# EAGLE design SPI Bus Buffer (EAGLE 7.2.0)
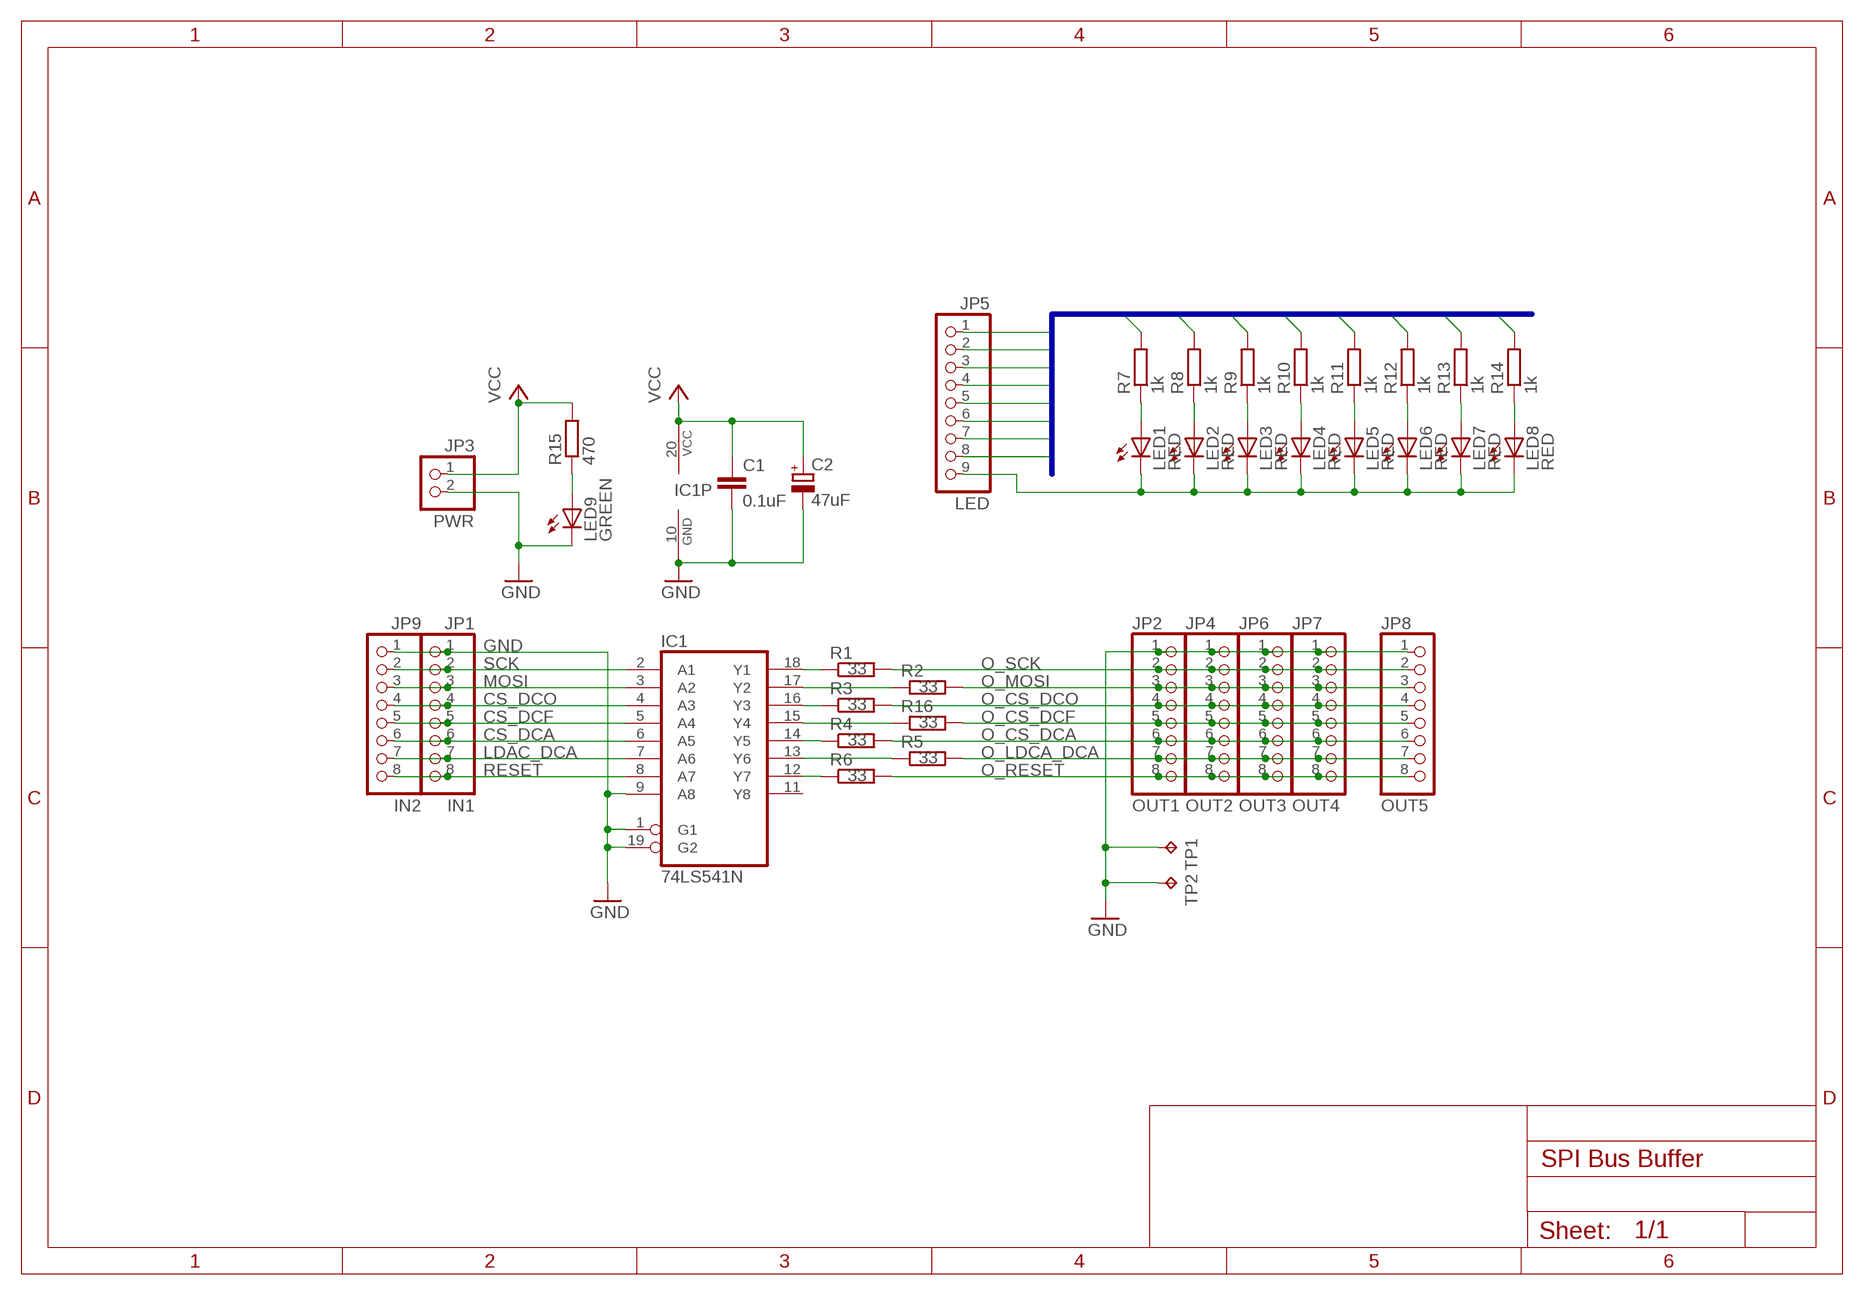
[diagram p0: schematic, sheet 1]

## Parts
C1  0.1uF  C-EU050-024X044  [C050-024X044]
C2  47uF  CPOL-EUE2.5-5  [E2,5-5]
IC1  74LS541N  [DIL20]
JP1  IN1  PINHD-1X8  [1X08]
JP2  OUT1  PINHD-1X8  [1X08]
JP3  PWR  PINHD-1X2  [1X02]
JP4  OUT2  PINHD-1X8  [1X08]
JP5  LED  PINHD-1X9  [1X09]
JP6  OUT3  PINHD-1X8  [1X08]
JP7  OUT4  PINHD-1X8  [1X08]
JP8  OUT5  PINHD-1X8  [1X08]
JP9  IN2  PINHD-1X8  [1X08]
LED1  RED  LED3MM  [LED3MM]
LED2  RED  LED3MM  [LED3MM]
LED3  RED  LED3MM  [LED3MM]
LED4  RED  LED3MM  [LED3MM]
LED5  RED  LED3MM  [LED3MM]
LED6  RED  LED3MM  [LED3MM]
LED7  RED  LED3MM  [LED3MM]
LED8  RED  LED3MM  [LED3MM]
LED9  GREEN  LED3MM  [LED3MM]
R1  33  R-EU_0207/7  [0207/7]
R2  33  R-EU_0207/7  [0207/7]
R3  33  R-EU_0207/7  [0207/7]
R4  33  R-EU_0207/7  [0207/7]
R5  33  R-EU_0207/7  [0207/7]
R6  33  R-EU_0207/7  [0207/7]
R7  1k  R-EU_0207/7  [0207/7]
R8  1k  R-EU_0207/7  [0207/7]
R9  1k  R-EU_0207/7  [0207/7]
R10  1k  R-EU_0207/7  [0207/7]
R11  1k  R-EU_0207/7  [0207/7]
R12  1k  R-EU_0207/7  [0207/7]
R13  1k  R-EU_0207/7  [0207/7]
R14  1k  R-EU_0207/7  [0207/7]
R15  470  R-EU_0207/7  [0207/7]
R16  33  R-EU_0207/7  [0207/7]
TP1  TPPAD1-13  [P1-13]
TP2  TPPAD1-13  [P1-13]

## Nets
CS_DCA: IC1.6(A5) JP1.6 JP9.6
CS_DCF: IC1.5(A4) JP1.5 JP9.5
CS_DCO: IC1.4(A3) JP1.4 JP9.4
GND: C1.2 C2.- IC1.1(G1) IC1.9(A8) IC1.10(GND) IC1.19(G2) JP1.1 JP2.1 JP3.2 JP4.1 JP6.1 JP7.1 JP8.1 JP9.1 LED9.K(C) TP1.TP TP2.TP
LDAC_DCA: IC1.7(A6) JP1.7 JP9.7
LEDS1: JP5.1 R7.2
LEDS2: JP5.2 R8.2
LEDS3: JP5.3 R9.2
LEDS4: JP5.4 R10.2
LEDS5: JP5.5 R11.2
LEDS6: JP5.6 R12.2
LEDS7: JP5.7 R13.2
LEDS8: JP5.8 R14.2
MOSI: IC1.3(A2) JP1.3 JP9.3
N$1: IC1.18(Y1) R1.1
N$2: IC1.17(Y2) R2.1
N$3: IC1.16(Y3) R3.1
N$4: IC1.14(Y5) R4.1
N$5: IC1.13(Y6) R5.1
N$6: IC1.12(Y7) R6.1
N$7: LED1.A R7.1
N$8: LED2.A R8.1
N$9: LED3.A R9.1
N$10: LED4.A R10.1
N$11: LED5.A R11.1
N$12: LED6.A R12.1
N$13: LED7.A R13.1
N$14: LED8.A R14.1
N$15: LED9.A R15.1
N$16: IC1.15(Y4) R16.1
N$17: JP5.9 LED1.K(C) LED2.K(C) LED3.K(C) LED4.K(C) LED5.K(C) LED6.K(C) LED7.K(C) LED8.K(C)
O_CS_DCA: JP2.6 JP4.6 JP6.6 JP7.6 JP8.6 R4.2
O_CS_DCF: JP2.5 JP4.5 JP6.5 JP7.5 JP8.5 R16.2
O_CS_DCO: JP2.4 JP4.4 JP6.4 JP7.4 JP8.4 R3.2
O_LDCA_DCA: JP2.7 JP4.7 JP6.7 JP7.7 JP8.7 R5.2
O_MOSI: JP2.3 JP4.3 JP6.3 JP7.3 JP8.3 R2.2
O_RESET: JP2.8 JP4.8 JP6.8 JP7.8 JP8.8 R6.2
O_SCK: JP2.2 JP4.2 JP6.2 JP7.2 JP8.2 R1.2
RESET: IC1.8(A7) JP1.8 JP9.8
SCK: IC1.2(A1) JP1.2 JP9.2
VCC: C1.1 C2.+ IC1.20(VCC) JP3.1 R15.2
Unconnected: IC1.11(Y8)

## Buses
LEDS[1..8]

## Library data of the parts
C1 = rcl:C-EU: CAPACITOR, European symbol
C2 = rcl:CPOL-EU: POLARIZED CAPACITOR, European symbol
IC1 = 74xx-us:74*541: Octal BUFFER and LINE DRIVER, 3-state
JP1 JP2 JP4 JP6-JP9 = pinhead:PINHD-1X8: PIN HEADER
JP3 = pinhead:PINHD-1X2: PIN HEADER
JP5 = pinhead:PINHD-1X9: PIN HEADER
LED1-LED9 = led:LED: LED OSRAM: - CHIPLED LG R971, LG N971, LY N971, LG Q971, LY Q971, LO R971, LY R971 LH N974, LH R974 LS Q976, LO Q976, LY Q976 LO Q996 - Hyper CHIPLED LW Q18S LB Q993, LB Q99A, LB R99A - SideLED LS A670, LO A670, LY A670, LG A670, LP A670 LB A673, LV A673, LT A673, LW A673 LH A674 LY A675 LS A676, LA A676, LO A676, LY A676, LW A676 LS A679, LY A679, LG A679 - Hyper Micro SIDELED® LS Y876, LA Y876, LO Y876, LY Y876 LT Y87S - SmartLED LW L88C, LW L88S LB L89C, LB L89S, LG L890 LS L89K, LO L89K, LY L89K LS L896, LA L896, LO L896, LY L896 - TOPLED LS T670, LO T670, LY T670, LG T670, LP T670 LSG T670, LSP T670, LSY T670, LOP T670, LYG T670 LG T671, LOG T671, LSG T671 LB T673, LV T673, LT T673, LW T673 LH T674 LS T676, LA T676, LO T676, LY T676, LB T676, LH T676, LSB T676, LW T676 LB T67C, LV T67C, LT T67C, LS T67K, LO T67K, LY T67K, LW E67C LS E67B, LA E67B, LO E67B, LY E67B, LB E67C, LV E67C, LT E67C LW T67C LS T679, LY T679, LG T679 LS T770, LO T770, LY T770, LG T770, LP T770 LB T773, LV T773, LT T773, LW T773 LH T774 LS E675, LA E675, LY E675, LS T675 LS T776, LA T776, LO T776, LY T776, LB T776 LHGB T686 LT T68C, LB T68C - Hyper Mini TOPLED® LB M676 - Mini TOPLED Santana® LG M470 LS M47K, LO M47K, LY M47K Source: http://www.osram.convergy.de LUXEON: - LUMILED® LXK2-PW12-R00, LXK2-PW12-S00, LXK2-PW14-U00, LXK2-PW14-V00 LXK2-PM12-R00, LXK2-PM12-S00, LXK2-PM14-U00 LXK2-PE12-Q00, LXK2-PE12-R00, LXK2-PE12-S00, LXK2-PE14-T00, LXK2-PE14-U00 LXK2-PB12-K00, LXK2-PB12-L00, LXK2-PB12-M00, LXK2-PB14-N00, LXK2-PB14-P00, LXK2-PB14-Q00 LXK2-PR12-L00, LXK2-PR12-M00, LXK2-PR14-Q00, LXK2-PR14-R00 LXK2-PD12-Q00, LXK2-PD12-R00, LXK2-PD12-S00 LXK2-PH12-R00, LXK2-PH12-S00 LXK2-PL12-P00, LXK2-PL12-Q00, LXK2-PL12-R00 Source: www.luxeon.com KINGBRIGHT: KA-3528ASYC Source: www.kingbright.com
R1-R16 = rcl:R-EU_: RESISTOR, European symbol
TP1 TP2 = testpad:TP: Test pad

## Board
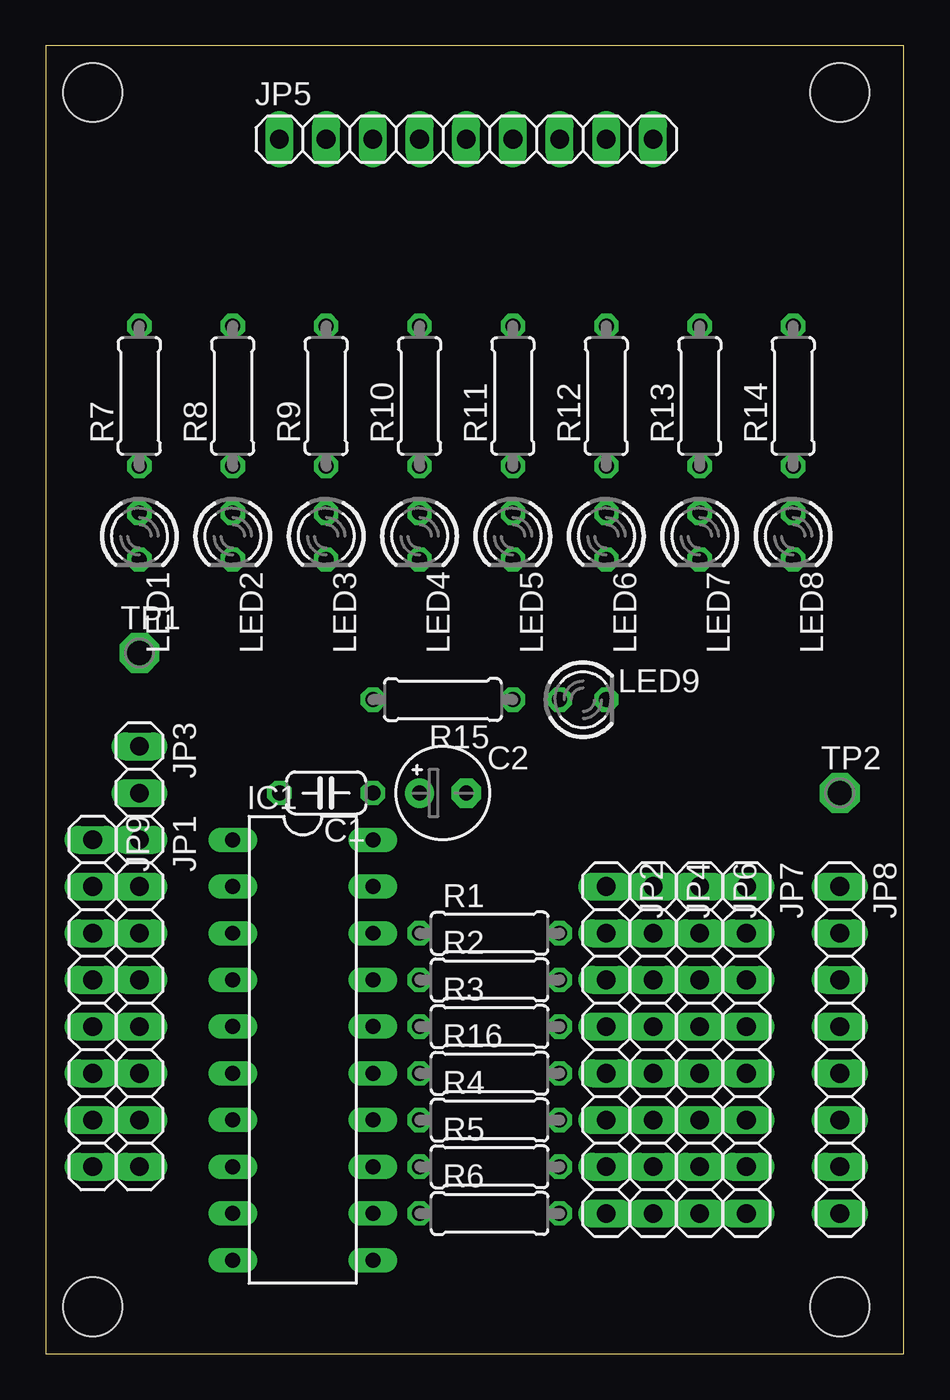
[diagram p1: board, top side]
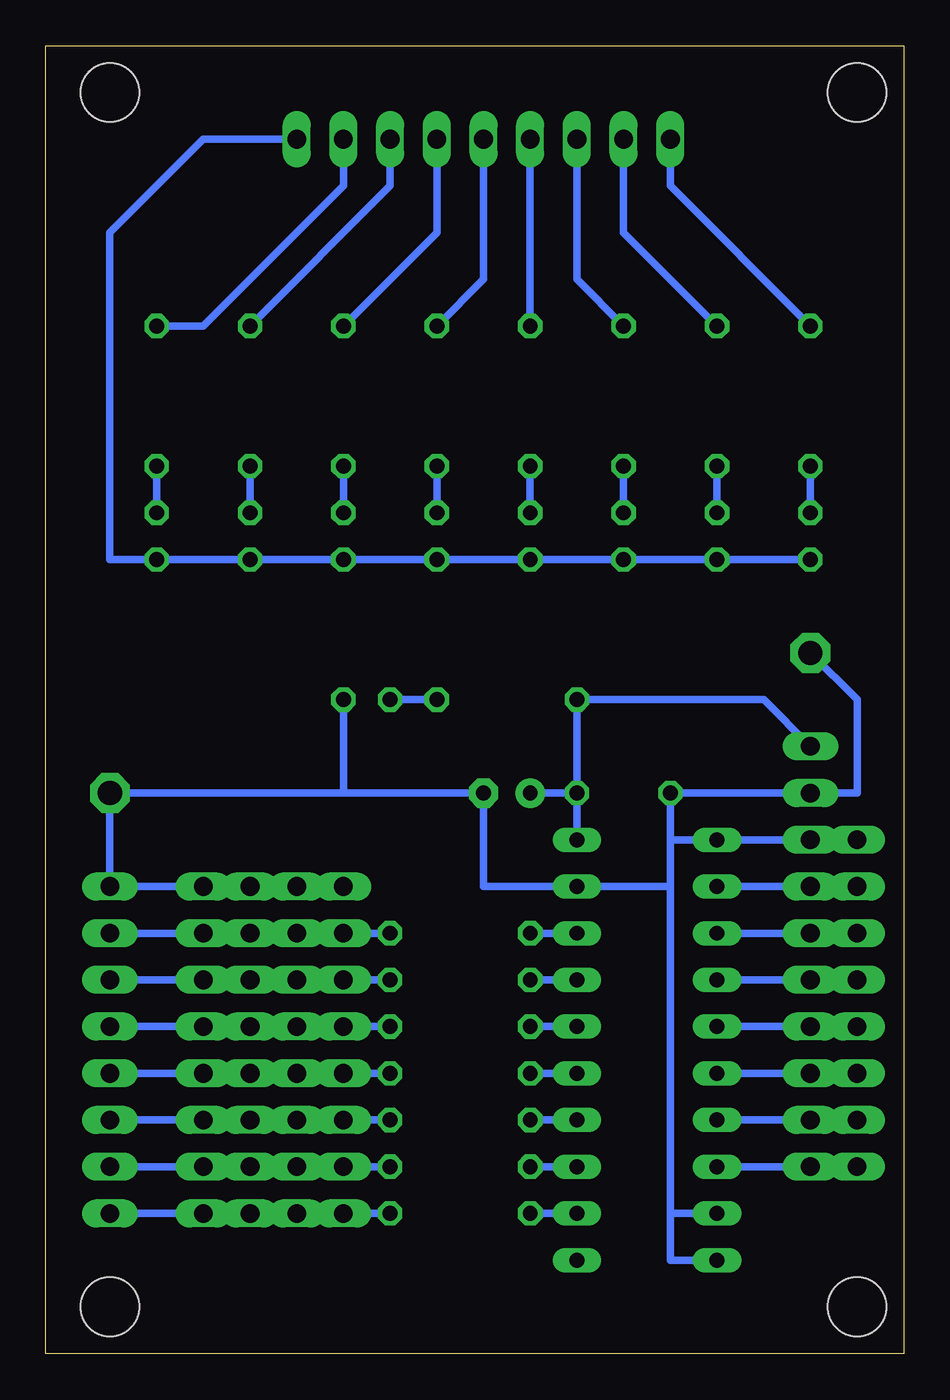
[diagram p2: board, bottom side, seen from below]

Size 46.66 x 71.11 mm. Coordinates in mm from the lower left corner, seen from the top.
Outline: 0,0 46.66,0 46.66,71.11 0,71.11 0,0
Copper layers (1*16): Top 0.035mm / dielectric 1.5mm / Bottom 0.035mm
Design rules "default": minimum track width 10mil, minimum drill 24mil, track to track 8mil, track to pad 8mil, pad to pad 8mil, via to via 8mil, smd to smd 8mil, copper to edge 40mil, drill to drill 8mil, minimum pad ring 10mil, minimum via ring 8mil, stop-mask expansion 4mil, vias tented up to drill 0mil, thermal gap 10mil
Holes 3.2 mm at 2.54,2.54 43.18,2.54 2.54,68.58 43.18,68.58

### Footprints (pad centres in the part's own frame; a part is rotated, then mirrored left to right if it is on the bottom)
C050-024X044 = drill 0.813 octagon: 1 -2.54,0; 2 2.54,0
E2,5-5 = drill 0.813 pad 1.6: + -1.27,0 | drill 0.813 pad 1.6 octagon: - 1.27,0
DIL20 = drill 0.813 long: 1 -11.43,-3.81; 2 -8.89,-3.81; 3 -6.35,-3.81; 4 -3.81,-3.81; 5 -1.27,-3.81; 6 1.27,-3.81; 7 3.81,-3.81; 8 6.35,-3.81; 9 8.89,-3.81; 10 11.43,-3.81; 11 11.43,3.81; 12 8.89,3.81; 13 6.35,3.81; 14 3.81,3.81; 15 1.27,3.81; 16 -1.27,3.81; 17 -3.81,3.81; 18 -6.35,3.81; 19 -8.89,3.81; 20 -11.43,3.81
1X08 = drill 1.016 long: 1 -8.89,0; 2 -6.35,0; 3 -3.81,0; 4 -1.27,0; 5 1.27,0; 6 3.81,0; 7 6.35,0; 8 8.89,0
1X02 = drill 1.016 long: 1 -1.27,0; 2 1.27,0
1X09 = drill 1.016 long: 1 -10.16,0; 2 -7.62,0; 3 -5.08,0; 4 -2.54,0; 5 0,0; 6 2.54,0; 7 5.08,0; 8 7.62,0; 9 10.16,0
LED3MM = drill 0.813 octagon: A -1.27,0; K 1.27,0
0207/7 = drill 0.813 octagon: 1 -3.81,0; 2 3.81,0
P1-13 = drill 1.321 pad 2.159 octagon: TP 0,0

### Placement (x,y rotation side)
C1  15.24,30.48 180 top
C2  21.59,30.48 0 top
IC1  13.97,16.51 270 top
JP1  5.08,19.05 270 top
JP2  30.48,16.51 270 top
JP3  5.08,31.75 270 top
JP4  33.02,16.51 270 top
JP5  22.86,66.04 0 top
JP6  35.56,16.51 270 top
JP7  38.1,16.51 270 top
JP8  43.18,16.51 270 top
JP9  2.54,19.05 270 top
LED1  5.08,44.45 270 top
LED2  10.16,44.45 270 top
LED3  15.24,44.45 270 top
LED4  20.32,44.45 270 top
LED5  25.4,44.45 270 top
LED6  30.48,44.45 270 top
LED7  35.56,44.45 270 top
LED8  40.64,44.45 270 top
LED9  29.21,35.56 0 top
R1  24.13,22.86 0 top
R2  24.13,20.32 0 top
R3  24.13,17.78 0 top
R4  24.13,12.7 0 top
R5  24.13,10.16 0 top
R6  24.13,7.62 0 top
R7  5.08,52.07 90 top
R8  10.16,52.07 90 top
R9  15.24,52.07 90 top
R10  20.32,52.07 90 top
R11  25.4,52.07 90 top
R12  30.48,52.07 90 top
R13  35.56,52.07 90 top
R14  40.64,52.07 90 top
R15  21.59,35.56 180 top
R16  24.13,15.24 0 top
TP1  5.08,38.1 0 top
TP2  43.18,30.48 0 top

### Tracks (layer width: path | path; a pad name or v marks a point on that pad's centre or on a via)
CS_DCA
  Bottom 0.406: IC1.6 JP1.6 JP9.6
CS_DCF
  Bottom 0.406: IC1.5 JP1.5 JP9.5
CS_DCO
  Bottom 0.406: IC1.4 JP1.4 JP9.4
GND
  Bottom 0.406: 12.7,27.94 C1.2 JP3.2 2.54,30.48 2.54,35.56 TP1.TP | 12.7,27.94 12.7,25.4 | 12.7,25.4 12.7,7.62 | 12.7,7.62 12.7,5.08 IC1.10 | IC1.9 12.7,7.62 | 12.7,25.4 IC1.19 22.86,25.4 C2.- 30.48,30.48 | 12.7,27.94 IC1.1 JP1.1 JP9.1 | LED9.K 30.48,30.48 | JP2.1 JP4.1 JP6.1 JP7.1 JP8.1 TP2.TP 30.48,30.48
LDAC_DCA
  Bottom 0.406: IC1.7 JP1.7 JP9.7
LEDS1
  Bottom 0.406: JP5.1 12.7,63.5 R7.2
LEDS2
  Bottom 0.406: JP5.2 15.24,60.96 R8.2
LEDS3
  Bottom 0.406: JP5.3 17.78,58.42 R9.2
LEDS4
  Bottom 0.406: JP5.4 R10.2
LEDS5
  Bottom 0.406: JP5.5 22.86,58.42 R11.2
LEDS6
  Bottom 0.406: JP5.6 25.4,60.96 R12.2
LEDS7
  Bottom 0.406: JP5.7 27.94,63.5 R13.2
LEDS8
  Bottom 0.406: JP5.8 30.48,63.5 38.1,55.88 R14.2
MOSI
  Bottom 0.406: IC1.3 JP1.3 JP9.3
N$1
  Bottom 0.406: R1.1 IC1.18
N$2
  Bottom 0.406: R2.1 IC1.17
N$3
  Bottom 0.406: R3.1 IC1.16
N$4
  Bottom 0.406: R4.1 IC1.14
N$5
  Bottom 0.406: R5.1 IC1.13
N$6
  Bottom 0.406: R6.1 IC1.12
N$7
  Bottom 0.406: R7.1 LED1.A
N$8
  Bottom 0.406: R8.1 LED2.A
N$9
  Bottom 0.406: R9.1 LED3.A
N$10
  Bottom 0.406: R10.1 LED4.A
N$11
  Bottom 0.406: R11.1 LED5.A
N$12
  Bottom 0.406: LED6.A R12.1
N$13
  Bottom 0.406: LED7.A R13.1
N$14
  Bottom 0.406: LED8.A R14.1
N$15
  Bottom 0.406: R15.1 LED9.A
N$16
  Bottom 0.406: IC1.15 R16.1
N$17
  Bottom 0.406: LED1.K LED2.K LED3.K LED4.K LED5.K LED6.K LED7.K LED8.K 43.18,43.18 43.18,60.96 38.1,66.04 JP5.9
O_CS_DCA
  Bottom 0.406: R4.2 JP2.6 JP4.6 JP6.6 JP7.6 JP8.6
O_CS_DCF
  Bottom 0.406: R16.2 JP2.5 JP4.5 JP6.5 JP7.5 JP8.5
O_CS_DCO
  Bottom 0.406: R3.2 JP2.4 JP4.4 JP6.4 JP7.4 JP8.4
O_LDCA_DCA
  Bottom 0.406: R5.2 JP2.7 JP4.7 JP6.7 JP7.7 JP8.7
O_MOSI
  Bottom 0.406: R2.2 JP2.3 JP4.3 JP6.3 JP7.3 JP8.3
O_RESET
  Bottom 0.406: R6.2 JP2.8 JP4.8 JP6.8 JP7.8 JP8.8
O_SCK
  Bottom 0.406: R1.2 JP2.2 JP4.2 JP6.2 JP7.2 JP8.2
RESET
  Bottom 0.406: IC1.8 JP1.8 JP9.8
SCK
  Bottom 0.406: IC1.2 JP1.2 JP9.2
VCC
  Bottom 0.406: C1.1 IC1.20 | C1.1 C2.+ | JP3.1 7.62,35.56 R15.2 C1.1